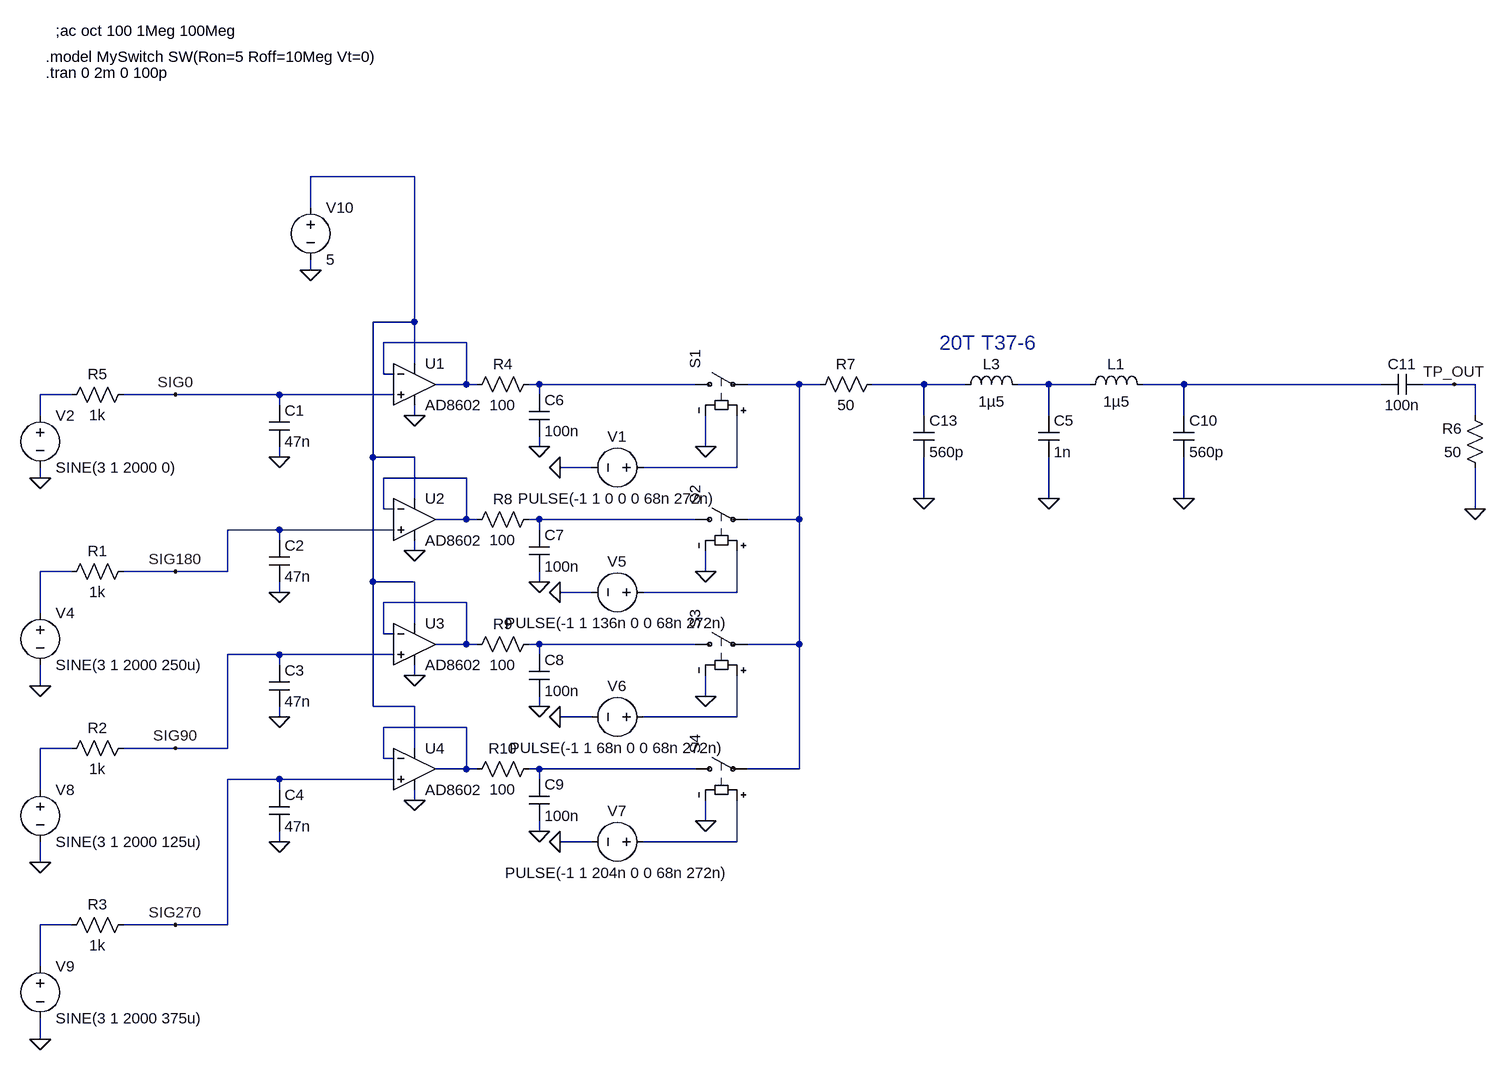
[diagram p0: schematic 4020 QSE 3.5MHz with 8MHz LPF 1.asc]
4020 QSE 3.5MHz with 8MHz LPF 1.asc, the LTspice schematic file:
Version 4
SHEET 1 2992 1808
WIRE -1584 -128 -1744 -128
WIRE -1744 -80 -1744 -128
WIRE -1744 16 -1744 0
WIRE -1584 96 -1584 -128
WIRE -1584 96 -1648 96
WIRE -1504 128 -1632 128
WIRE -1584 160 -1584 96
WIRE -1632 176 -1632 128
WIRE -1616 176 -1632 176
WIRE -1504 192 -1504 128
WIRE -1504 192 -1552 192
WIRE -1488 192 -1504 192
WIRE -1392 192 -1408 192
WIRE -1152 192 -1392 192
WIRE -992 192 -1072 192
WIRE -960 192 -992 192
WIRE -800 192 -880 192
WIRE -736 192 -800 192
WIRE -608 192 -656 192
WIRE -544 192 -608 192
WIRE -400 192 -464 192
WIRE -96 192 -400 192
WIRE 16 192 -32 192
WIRE 48 192 16 192
WIRE -2112 208 -2160 208
WIRE -1952 208 -2032 208
WIRE -1792 208 -1952 208
WIRE -1616 208 -1792 208
WIRE -1392 208 -1392 192
WIRE -1792 224 -1792 208
WIRE -2160 240 -2160 208
WIRE -1584 240 -1584 224
WIRE -800 240 -800 192
WIRE -608 240 -608 192
WIRE -400 240 -400 192
WIRE 48 240 48 192
WIRE -1392 288 -1392 272
WIRE -1136 288 -1136 240
WIRE -1792 304 -1792 288
WIRE -1648 304 -1648 96
WIRE -1584 304 -1648 304
WIRE -1312 320 -1360 320
WIRE -1088 320 -1088 240
WIRE -1088 320 -1232 320
WIRE -2160 336 -2160 320
WIRE -1504 336 -1632 336
WIRE -1584 368 -1584 304
WIRE -800 368 -800 304
WIRE -608 368 -608 304
WIRE -400 368 -400 304
WIRE -1632 384 -1632 336
WIRE -1616 384 -1632 384
WIRE 48 384 48 320
WIRE -1504 400 -1504 336
WIRE -1504 400 -1552 400
WIRE -1488 400 -1504 400
WIRE -1392 400 -1408 400
WIRE -1152 400 -1392 400
WIRE -992 400 -992 192
WIRE -992 400 -1072 400
WIRE -1792 416 -1872 416
WIRE -1616 416 -1792 416
WIRE -1392 416 -1392 400
WIRE -1792 432 -1792 416
WIRE -1584 448 -1584 432
WIRE -2112 480 -2160 480
WIRE -1952 480 -2032 480
WIRE -1872 480 -1872 416
WIRE -1872 480 -1952 480
WIRE -1136 480 -1136 448
WIRE -1648 496 -1648 304
WIRE -1584 496 -1648 496
WIRE -1392 496 -1392 480
WIRE -1792 512 -1792 496
WIRE -1312 512 -1360 512
WIRE -1088 512 -1088 448
WIRE -1088 512 -1232 512
WIRE -1504 528 -1632 528
WIRE -2160 544 -2160 480
WIRE -1584 560 -1584 496
WIRE -1632 576 -1632 528
WIRE -1616 576 -1632 576
WIRE -1504 592 -1504 528
WIRE -1504 592 -1552 592
WIRE -1488 592 -1504 592
WIRE -1392 592 -1408 592
WIRE -1152 592 -1392 592
WIRE -992 592 -992 400
WIRE -992 592 -1072 592
WIRE -1792 608 -1872 608
WIRE -1616 608 -1792 608
WIRE -1392 608 -1392 592
WIRE -1792 624 -1792 608
WIRE -1584 640 -1584 624
WIRE -2160 656 -2160 624
WIRE -1136 672 -1136 640
WIRE -1648 688 -1648 496
WIRE -1584 688 -1648 688
WIRE -1392 688 -1392 672
WIRE -1792 704 -1792 688
WIRE -1312 704 -1360 704
WIRE -1088 704 -1088 640
WIRE -1088 704 -1232 704
WIRE -1504 720 -1632 720
WIRE -2112 752 -2160 752
WIRE -1952 752 -2032 752
WIRE -1872 752 -1872 608
WIRE -1872 752 -1952 752
WIRE -1584 752 -1584 688
WIRE -1632 768 -1632 720
WIRE -1616 768 -1632 768
WIRE -1504 784 -1504 720
WIRE -1504 784 -1552 784
WIRE -1488 784 -1504 784
WIRE -1392 784 -1408 784
WIRE -1152 784 -1392 784
WIRE -992 784 -992 592
WIRE -992 784 -1072 784
WIRE -1792 800 -1872 800
WIRE -1616 800 -1792 800
WIRE -1392 800 -1392 784
WIRE -2160 816 -2160 752
WIRE -1792 816 -1792 800
WIRE -1584 832 -1584 816
WIRE -1136 864 -1136 832
WIRE -1392 880 -1392 864
WIRE -1792 896 -1792 880
WIRE -1312 896 -1360 896
WIRE -1088 896 -1088 832
WIRE -1088 896 -1232 896
WIRE -2160 928 -2160 896
WIRE -2112 1024 -2160 1024
WIRE -1952 1024 -2032 1024
WIRE -1872 1024 -1872 800
WIRE -1872 1024 -1952 1024
WIRE -2160 1088 -2160 1024
WIRE -2160 1200 -2160 1168
FLAG -2160 336 0
FLAG -1136 288 0
FLAG -1360 512 0
FLAG -1360 704 0
FLAG -1360 896 0
FLAG -1136 480 0
FLAG -1136 672 0
FLAG -1136 864 0
FLAG -1360 320 0
FLAG -1952 208 SIG0
FLAG -2160 656 0
FLAG -1952 480 SIG180
FLAG -2160 928 0
FLAG -1952 752 SIG90
FLAG -2160 1200 0
FLAG -1952 1024 SIG270
FLAG -1792 304 0
FLAG -1792 512 0
FLAG -1792 704 0
FLAG -1792 896 0
FLAG -1744 16 0
FLAG -1584 240 0
FLAG -1584 448 0
FLAG -1584 640 0
FLAG -1584 832 0
FLAG 48 384 0
FLAG 16 192 TP_OUT
FLAG -1392 288 0
FLAG -1392 496 0
FLAG -1392 688 0
FLAG -1392 880 0
FLAG -608 368 0
FLAG -400 368 0
FLAG -800 368 0
SYMBOL voltage -2160 224 R0
WINDOW 39 24 132 Left 2
SYMATTR Value2 AC 1
SYMATTR InstName V2
SYMATTR Value SINE(3 1 2000 0)
SYMBOL sw -1168 192 R270
SYMATTR InstName S1
SYMATTR Value ""
SYMATTR SpiceModel MySwitch
SYMBOL sw -1168 400 R270
SYMATTR InstName S2
SYMATTR Value ""
SYMATTR SpiceModel MySwitch
SYMBOL sw -1168 592 R270
SYMATTR InstName S3
SYMATTR Value ""
SYMATTR SpiceModel MySwitch
SYMBOL sw -1168 784 R270
SYMATTR InstName S4
SYMATTR Value ""
SYMATTR SpiceModel MySwitch
SYMBOL voltage -1216 512 R90
WINDOW 0 -32 56 VBottom 2
WINDOW 3 32 56 VTop 2
WINDOW 123 32 56 VTop 2
WINDOW 39 32 56 VTop 2
SYMATTR InstName V5
SYMATTR Value PULSE(-1 1 136n 0 0 68n 272n)
SYMBOL voltage -1216 704 R90
WINDOW 0 -32 56 VBottom 2
WINDOW 3 32 56 VTop 2
WINDOW 123 32 56 VTop 2
WINDOW 39 32 56 VTop 2
SYMATTR InstName V6
SYMATTR Value PULSE(-1 1 68n 0 0 68n 272n)
SYMBOL voltage -1216 896 R90
WINDOW 0 -32 56 VBottom 2
WINDOW 3 32 56 VTop 2
WINDOW 123 32 56 VTop 2
WINDOW 39 32 56 VTop 2
SYMATTR InstName V7
SYMATTR Value PULSE(-1 1 204n 0 0 68n 272n)
SYMBOL voltage -1216 320 R90
WINDOW 0 -32 56 VBottom 2
WINDOW 3 32 56 VTop 2
WINDOW 123 32 56 VTop 2
WINDOW 39 32 56 VTop 2
SYMATTR InstName V1
SYMATTR Value PULSE(-1 1 0 0 0 68n 272n)
SYMBOL res -2128 224 R270
WINDOW 0 32 56 VTop 2
WINDOW 3 0 56 VBottom 2
SYMATTR InstName R5
SYMATTR Value 1k
SYMBOL voltage -2160 528 R0
WINDOW 39 24 132 Left 2
SYMATTR Value2 AC 1
SYMATTR InstName V4
SYMATTR Value SINE(3 1 2000 250u)
SYMBOL res -2128 496 R270
WINDOW 0 32 56 VTop 2
WINDOW 3 0 56 VBottom 2
SYMATTR InstName R1
SYMATTR Value 1k
SYMBOL voltage -2160 800 R0
WINDOW 39 24 132 Left 2
SYMATTR Value2 AC 1
SYMATTR InstName V8
SYMATTR Value SINE(3 1 2000 125u)
SYMBOL res -2128 768 R270
WINDOW 0 32 56 VTop 2
WINDOW 3 0 56 VBottom 2
SYMATTR InstName R2
SYMATTR Value 1k
SYMBOL voltage -2160 1072 R0
WINDOW 39 24 132 Left 2
SYMATTR Value2 AC 1
SYMATTR InstName V9
SYMATTR Value SINE(3 1 2000 375u)
SYMBOL res -2128 1040 R270
WINDOW 0 32 56 VTop 2
WINDOW 3 0 56 VBottom 2
SYMATTR InstName R3
SYMATTR Value 1k
SYMBOL cap -1808 224 R0
SYMATTR InstName C1
SYMATTR Value 47n
SYMBOL cap -1808 432 R0
SYMATTR InstName C2
SYMATTR Value 47n
SYMBOL cap -1808 624 R0
SYMATTR InstName C3
SYMATTR Value 47n
SYMBOL cap -1808 816 R0
SYMATTR InstName C4
SYMATTR Value 47n
SYMBOL Opamps\\AD8602 -1584 128 R0
SYMATTR InstName U1
SYMBOL voltage -1744 -96 R0
WINDOW 123 0 0 Left 0
WINDOW 39 24 124 Left 2
SYMATTR InstName V10
SYMATTR Value 5
SYMBOL Opamps\\AD8602 -1584 336 R0
SYMATTR InstName U2
SYMBOL Opamps\\AD8602 -1584 528 R0
SYMATTR InstName U3
SYMBOL Opamps\\AD8602 -1584 720 R0
SYMATTR InstName U4
SYMBOL res 64 336 R180
WINDOW 0 36 76 Left 2
WINDOW 3 36 40 Left 2
SYMATTR InstName R6
SYMATTR Value 50
SYMBOL cap -32 176 R90
WINDOW 0 0 32 VBottom 2
WINDOW 3 32 32 VTop 2
SYMATTR InstName C11
SYMATTR Value 100n
SYMBOL res -1504 208 R270
WINDOW 0 32 56 VTop 2
WINDOW 3 0 56 VBottom 2
SYMATTR InstName R4
SYMATTR Value 100
SYMBOL cap -1408 208 R0
SYMATTR InstName C6
SYMATTR Value 100n
SYMBOL res -1504 416 R270
WINDOW 0 32 56 VTop 2
WINDOW 3 0 56 VBottom 2
SYMATTR InstName R8
SYMATTR Value 100
SYMBOL cap -1408 416 R0
SYMATTR InstName C7
SYMATTR Value 100n
SYMBOL res -1504 608 R270
WINDOW 0 32 56 VTop 2
WINDOW 3 0 56 VBottom 2
SYMATTR InstName R9
SYMATTR Value 100
SYMBOL cap -1408 608 R0
SYMATTR InstName C8
SYMATTR Value 100n
SYMBOL res -1504 800 R270
WINDOW 0 32 56 VTop 2
WINDOW 3 0 56 VBottom 2
SYMATTR InstName R10
SYMATTR Value 100
SYMBOL cap -1408 800 R0
SYMATTR InstName C9
SYMATTR Value 100n
SYMBOL res -976 208 R270
WINDOW 0 32 56 VTop 2
WINDOW 3 0 56 VBottom 2
SYMATTR InstName R7
SYMATTR Value 50
SYMBOL cap -624 240 R0
SYMATTR InstName C5
SYMATTR Value 1n
SYMBOL cap -416 240 R0
SYMATTR InstName C10
SYMATTR Value 560p
SYMBOL ind -560 208 R270
WINDOW 0 32 56 VTop 2
WINDOW 3 5 56 VBottom 2
SYMATTR InstName L1
SYMATTR Value 1µ5
SYMBOL cap -816 240 R0
SYMATTR InstName C13
SYMATTR Value 560p
SYMBOL ind -752 208 R270
WINDOW 0 32 56 VTop 2
WINDOW 3 5 56 VBottom 2
SYMATTR InstName L3
SYMATTR Value 1µ5
TEXT -2152 -288 Left 2 !.tran 0 2m 0 100p
TEXT -2152 -312 Left 2 !.model MySwitch SW(Ron=5 Roff=10Meg Vt=0)
TEXT -2136 -352 Left 2 !;ac oct 100 1Meg 100Meg
TEXT -776 128 Left 3 ;20T T37-6

The netlist it stands for:
* 4020 QSE 3.5MHz with 8MHz LPF 1.asc
V2 N008 0 SINE(3 1 2000 0) AC 1
S1 N003 N004 N009 0 MySwitch
S2 N011 N004 N013 0 MySwitch
S3 N015 N004 N016 0 MySwitch
S4 N019 N004 N020 0 MySwitch
V5 N013 0 PULSE(-1 1 136n 0 0 68n 272n)
V6 N016 0 PULSE(-1 1 68n 0 0 68n 272n)
V7 N020 0 PULSE(-1 1 204n 0 0 68n 272n)
V1 N009 0 PULSE(-1 1 0 0 0 68n 272n)
R5 N008 SIG0 1k
V4 N012 0 SINE(3 1 2000 250u) AC 1
R1 N012 SIG180 1k
V8 N018 0 SINE(3 1 2000 125u) AC 1
R2 N018 SIG90 1k
V9 N021 0 SINE(3 1 2000 375u) AC 1
R3 N021 SIG270 1k
C1 SIG0 0 47n
C2 SIG180 0 47n
C3 SIG90 0 47n
C4 SIG270 0 47n
XU1 SIG0 N002 N001 0 N002 AD8602  ; pins In+ In- V+ V- OUT
V10 N001 0 5
XU2 SIG180 N010 N001 0 N010 AD8602  ; pins In+ In- V+ V- OUT
XU3 SIG90 N014 N001 0 N014 AD8602  ; pins In+ In- V+ V- OUT
XU4 SIG270 N017 N001 0 N017 AD8602  ; pins In+ In- V+ V- OUT
R6 0 TP_OUT 50
C11 TP_OUT N007 100n
R4 N002 N003 100
C6 N003 0 100n
R8 N010 N011 100
C7 N011 0 100n
R9 N014 N015 100
C8 N015 0 100n
R10 N017 N019 100
C9 N019 0 100n
R7 N004 N005 50
C5 N006 0 1n
C10 N007 0 560p
L1 N006 N007 1µ5
C13 N005 0 560p
L3 N005 N006 1µ5
.tran 0 2m 0 100p
.model MySwitch SW(Ron=5 Roff=10Meg Vt=0)
;ac oct 100 1Meg 100Meg
* 20T T37-6
.backanno
.end